# EAGLE schematic FSAE Charger Control Board rev2 (EAGLE 8.4.1)
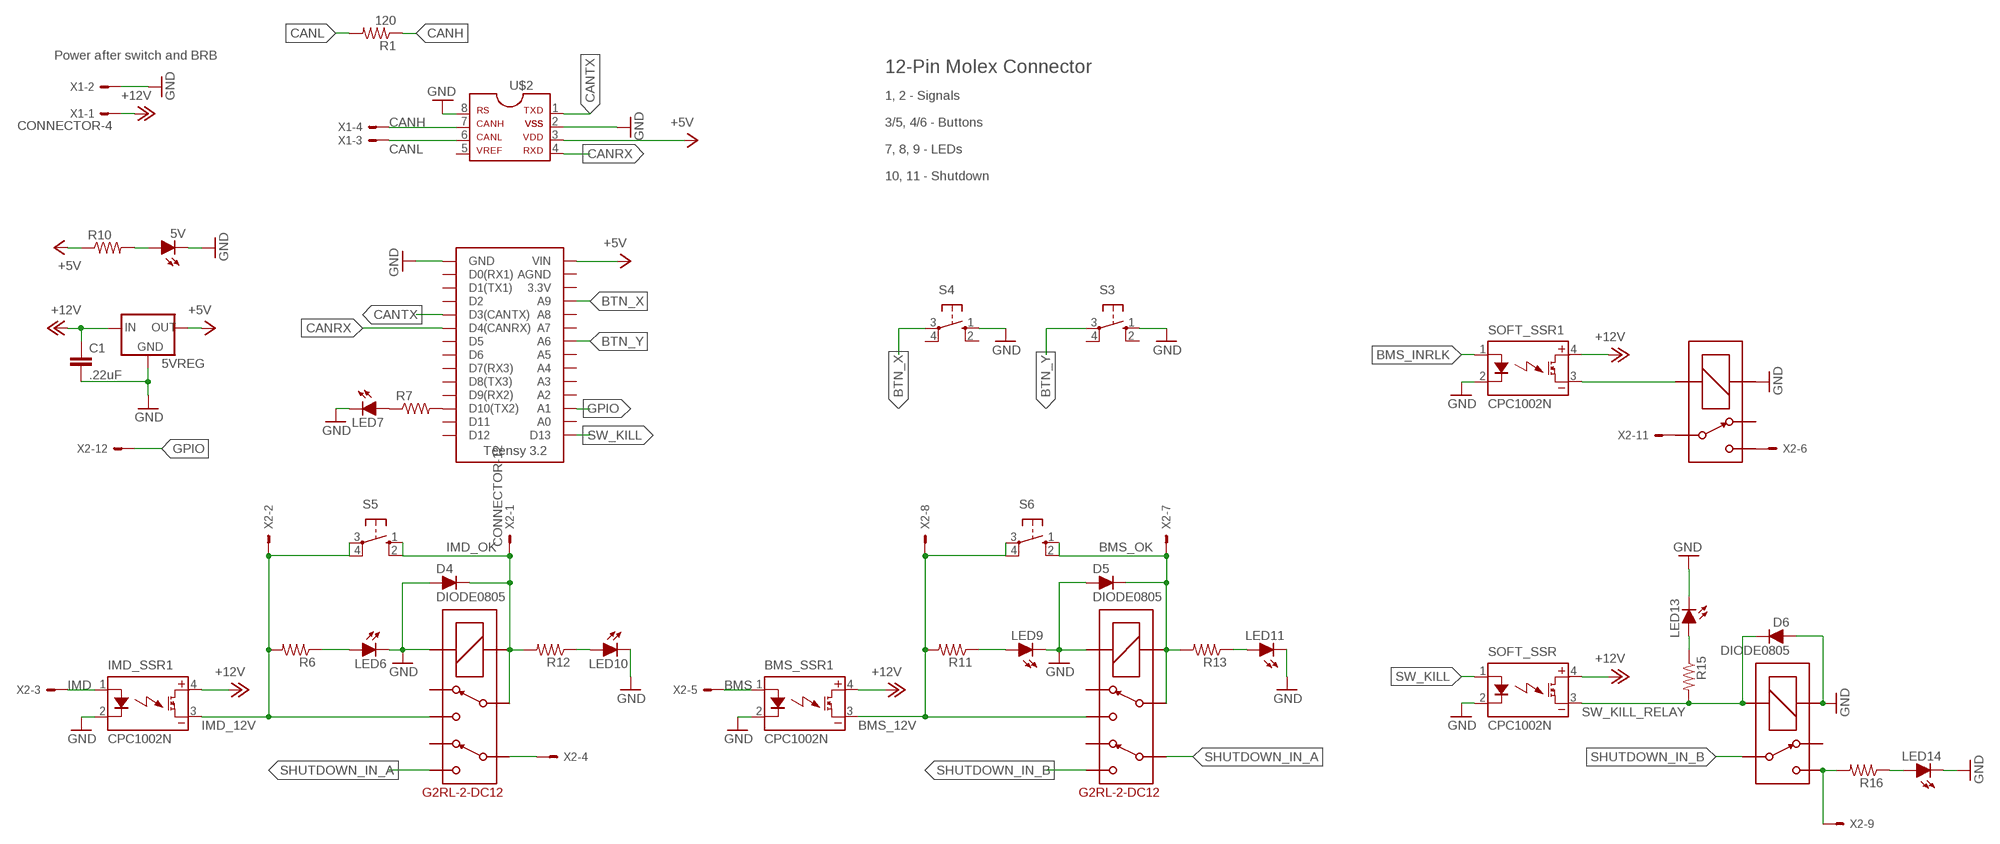
[diagram p0: schematic, sheet 1]

## Parts
5V  LED-0805  [LED-805]
5VREG  5VREG_LM340-NLM340MPX-5.0/NOPB  [SOT223]
BMS_SSR1  CPC1002N  [SOP04]
C1  .22uF  CAP0805  [0805]
D4  DIODE0805  [0805_D]
D5  DIODE0805  [0805_D]
D6  DIODE0805  [0805_D]
IMD_SSR1  CPC1002N  [SOP04]
LED6  LED-0805  [LED-805]
LED7  LED-0805  [LED-805]
LED9  LED-0805  [LED-805]
LED10  LED-0805  [LED-805]
LED11  LED-0805  [LED-805]
LED13  LED-0805  [LED-805]
LED14  LED-0805  [LED-805]
R1  120  RESISTOR0805-RES  [0805]
R6  RESISTOR0805-RES  [0805]
R7  RESISTOR0805-RES  [0805]
R10  RESISTOR0805-RES  [0805]
R11  RESISTOR0805-RES  [0805]
R12  RESISTOR0805-RES  [0805]
R13  RESISTOR0805-RES  [0805]
R15  RESISTOR0805-RES  [0805]
R16  RESISTOR0805-RES  [0805]
S3  BTN_10-XX  [B3F-10XX]
S4  BTN_10-XX  [B3F-10XX]
S5  BTN_10-XX  [B3F-10XX]
S6  BTN_10-XX  [B3F-10XX]
SOFT_SSR  CPC1002N  [SOP04]
SOFT_SSR1  CPC1002N  [SOP04]
U$1  TEENSY_3.2_SIMPLE  [TEENSY_3.2_SIMPLE]
U$2  MCP2551  [SOIC-08]
U$3  G5LE  [ZF112]
U$6  G2RL-2-DC12  [G2RL-2]
U$7  G2RL-2-DC12  [G2RL-2]
U$8  G5LE  [ZF112]
X1  CONNECTOR-4  [MINIFIT_5566-4]
X2  CONNECTOR-12  [MINIFIT_5566-12]

## Nets
+5V: 5VREG.3(OUT) R10.1 U$1.VIN U$2.3
+12V: 5VREG.1(IN) BMS_SSR1.4(DC+) C1.1 IMD_SSR1.4(DC+) SOFT_SSR1.4(DC+) SOFT_SSR.4(DC+) X1.1
BMS: BMS_SSR1.1(CONTROL+) X2.5
BMS_12V: BMS_SSR1.3(DC-) R11.2 S6.3(P) S6.4(P1) U$7.4 X2.8
BMS_INRLK: SOFT_SSR1.1(CONTROL+)
BMS_OK: D5.C R13.2 S6.1(S) S6.2(S1) U$7.3 U$7.COIL- X2.7
BTN_X: S4.3(P) U$1.A9
BTN_Y: S3.3(P) U$1.A6
CANH: R1.1 U$2.7 X1.4
CANL: R1.2 U$2.6 X1.3
CANRX: U$1.D4(CANRX) U$2.4
CANTX: U$1.D3(CANTX) U$2.1
GND: 5V.C 5VREG.2(GND) 5VREG.4(GND) BMS_SSR1.2(CONTROL-) C1.2 D4.A D5.A D6.A IMD_SSR1.2(CONTROL-) LED6.C LED7.C LED9.C LED10.C LED11.C LED13.C LED14.C S3.1(S) S4.1(S) SOFT_SSR1.2(CONTROL-) SOFT_SSR.2(CONTROL-) U$1.GND U$2.2 U$2.8 U$3.1(COIL+) U$6.COIL+ U$7.COIL+ U$8.1(COIL+) X1.2
GPIO: U$1.A1 X2.12
IMD: IMD_SSR1.1(CONTROL+) X2.3
IMD_12V: IMD_SSR1.3(DC-) R6.2 S5.3(P) S5.4(P1) U$6.4 X2.2
IMD_OK: D4.C R12.2 S5.1(S) S5.2(S1) U$6.3 U$6.COIL- X2.1
N$1: SOFT_SSR1.3(DC-) U$3.2(COIL-)
N$2: LED7.A R7.1
N$3: 5V.A R10.2
N$5: U$3.S X2.6
N$6: LED6.A R6.1
N$7: LED9.A R11.1
N$8: LED10.A R12.1
N$9: U$3.P X2.11
N$10: R7.2 U$1.D10(TX2)
N$12: LED11.A R13.1
N$13: LED14.A R16.1
N$14: LED13.A R15.1
SHUTDOWN_IN: U$6.6 X2.4
SHUTDOWN_IN_A: U$6.5 U$7.6
SHUTDOWN_IN_B: U$7.5 U$8.P
SHUTDOWN_OUT: R16.2 U$8.S X2.9
SW_KILL: SOFT_SSR.1(CONTROL+) U$1.D13
SW_KILL_RELAY: D6.C R15.2 SOFT_SSR.3(DC-) U$8.2(COIL-)
Unconnected: S3.2(S1) S3.4(P1) S4.2(S1) S4.4(P1) U$1.3.3V U$1.A0 U$1.A2 U$1.A3 U$1.A4 U$1.A5 U$1.A7 U$1.A8 U$1.AGND U$1.D0(RX1) U$1.D1(TX1) U$1.D2 U$1.D5 U$1.D6 U$1.D7(RX3) U$1.D8(TX3) U$1.D9(RX2) U$1.D11 U$1.D12 U$2.5 U$3.O U$6.2 U$6.7 U$7.2 U$7.7 U$8.O X2.10

## Notes on the sheet
- Power after switch and BRB
- 12-Pin Molex Connector
- 1, 2 - Signals
- 3/5, 4/6 - Buttons
- 7, 8, 9 - LEDs
- 10, 11 - Shutdown

## Library data of the parts
5V LED6 LED7 LED9-LED11 LED13 LED14 = HyTechDevices:LED: Light Emitting Diode (LED) Source: Dangerous Prototypes Eagle Library <https://github.com/DangerousPrototypes/Eagle_Part_Library>
5VREG = HyTechDevices:5VREG_LM340-N: Voltage Regulator 5v linear voltage regulator Datasheet <http://www.mouser.com/ProductDetail/Texas-Instruments/LM340MPX-50-NOPB/?qs=X1J7HmVL2ZGZwtTFRQ9ItA%3D%3D> MAX current out: 1.5A MAX voltage in: 35V
BMS_SSR1 IMD_SSR1 SOFT_SSR SOFT_SSR1 = HyTechDevices:CPC1002N: IXYS Solid State Relay .7A
C1 = HyTechDevices:CAP: Capacitor Standard 0603 ceramic capacitor, and 0.1" leaded capacitor.
D4-D6 = HyTechDevices:DIODE: DIODE general purpose rectifier
R1 R6 R7 R10-R13 R15 R16 = HyTechDevices:RESISTOR: Resistor Basic schematic elements and footprints for 0603, 1206, and PTH resistors.
S3-S6 = HyTechDevices:BTN_10-XX: Small momentary tactile push button; MPN: B3F-1000; OC_FARNELL: 176432; OC_NEWARK: 36M3542
U$1 = HyTechDevices:TEENSY_3.2_SIMPLE: Simple version of the Teensy 3.2 board that only uses the 2 main rows of pins, not the inner pins or the pins opposite the usb port.
U$2 = HyTechDevices:MCP2551: MCP2551 High-Speed CAN Transceiver Product Webpage <https://www.microchip.com/wwwproducts/en/MCP2551> Datasheet <http://ww1.microchip.com/downloads/en/DeviceDoc/21667f.pdf> This device is outdated It is replaced by MCP2561. Comparison Page <https://www.microchip.com/wwwproducts/ProductCompare/MCP2551/MCP2561> Product Webpage <https://www.microchip.com/wwwproducts/en/MCP2561> Datasheet <http://ww1.microchip.com/downloads/en/DeviceDoc/20005167C.pdf>
U$3 U$8 = HyTechDevices:G5LE: Omron G5LE SPST Relay 5 VDC, 12VDC, 24VDC models Coil voltage: 75% - 170% of nominal voltage Datasheet <https://www.omron.com/ecb/products/pdf/en-g5le.pdf>
U$6 U$7 = HyTechDevices:G2RL-2-DC12: Omron G2RL-2 Double Pull Double Throw Relay Coil Voltage: 12VDC (8.4-18VDC @60ºC) Contact Amperage: 8A at 30VDC Datasheet <https://www.omron.com/ecb/products/pdf/en-g2rl.pdf>
X1 = HyTechDevices:CONNECTOR-4: Mini-Fit Junior connector 4 pole Source: http://www.molex.com; OC_FARNELL: unknown; OC_NEWARK: unknown
X2 = HyTechDevices:CONNECTOR-12: Mini-Fit Junior connector 12 pole Source: http://www.molex.com; OC_FARNELL: unknown; OC_NEWARK: unknown